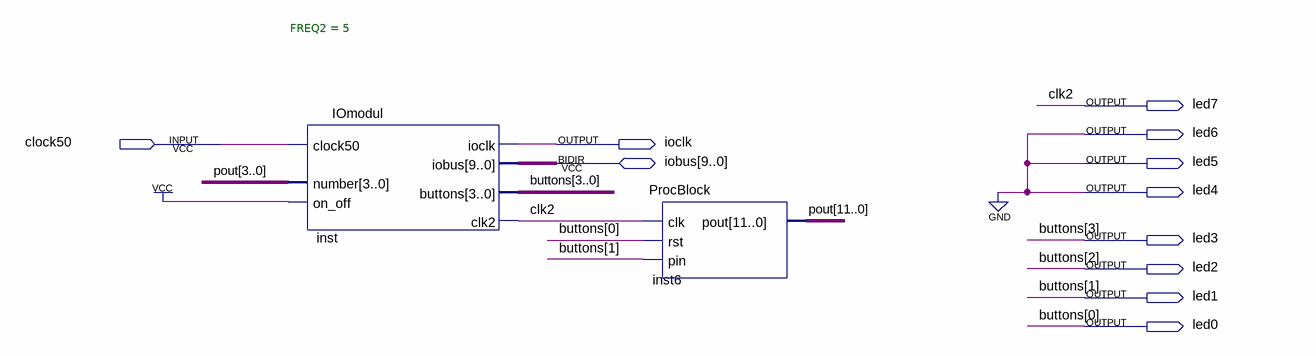
[diagram p0: schematic sheet]
// Quartus schematic logika.bdf as structural Verilog: 2 symbols, 11 pins
module logika (
  input  clock50,
  inout  [9:0] iobus,
  output led7,
  output led6,
  output ioclk,
  output led5,
  output led4,
  output led3,
  output led2,
  output led1,
  output led0
);

  wire [11:0] pout;

  IOmodul #(.FREQ2(5)) inst (
    .clock50(clock50), .number(pout[3:0]), .on_off(1'b1), .ioclk(ioclk), .clk2(led7),
    .buttons({led3, led2, led1, led0}), .iobus(iobus));
  ProcBlock inst6 (.clk(led7), .rst(led0), .pin(led1), .pout(pout));

  assign led4 = 1'b0;
  assign led5 = 1'b0;
  assign led6 = 1'b0;

  // Other names for the same wires on the sheet: buttons[3:0] = {led3, led2, led1, led0}; clk2 = led7
endmodule
